# Altium schematic sheet DRV8305-Q1.SchDoc
size A4
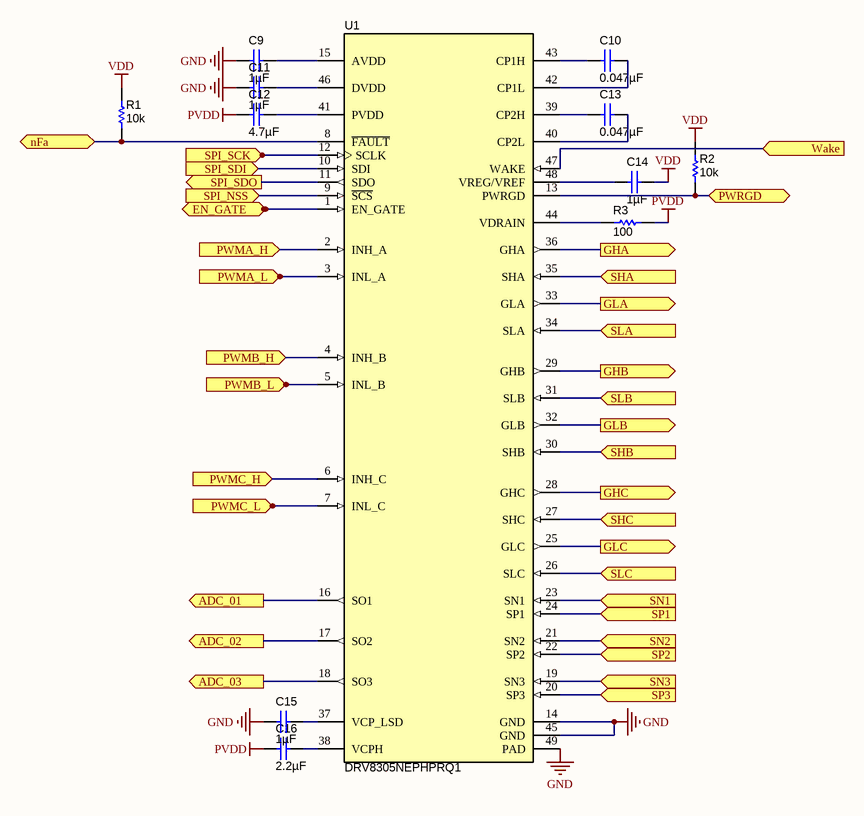
[diagram p0: DRV8305-Q1.SchDoc]

## Parts
C9  ValueDisplayed: 1µF  [0603L]  (hidden comment: C1608X7R1C105K)
C10  ValueDisplayed: 0.047µF  [0603L]  (hidden comment: C1608X7R1H473K)
C11  ValueDisplayed: 1µF  [0603L]  (hidden comment: C1608X7R1C105K)
C12  ValueDisplayed: 4.7µF  [0805L]  (hidden comment: GRM21BR71A475KA73L)
C13  ValueDisplayed: 0.047µF  [0603L]  (hidden comment: C1608X7R1H473K)
C14  ValueDisplayed: 1µF  [0603L]  (hidden comment: C1608X7R1C105K)
C15  ValueDisplayed: 1µF  [0603L]  (hidden comment: C1608X7R1C105K)
C16  ValueDisplayed: 2.2µF  [1210L]  (hidden comment: GRM32ER72A225KA35L)
R1  value 10k  [0603L]  (hidden comment: CRCW060310K0JNEA)
R2  value 10k  [0603L]  (hidden comment: CRCW060310K0JNEA)
R3  value 100  [0603L]  (hidden comment: CRCW0603100RJNEA)
U1  DRV8305NEPHPRQ1  [PHP0048G_N]

## Ports
ADC_01 (out), ADC_02 (out), ADC_03 (out), EN_GATE (in), GHA (out), GHB (out), GHC (out), GLA (out), GLB (out), GLC (out), nFa, PWMA_H (in), PWMA_L (in), PWMB_H (in), PWMB_L (in), PWMC_H (in), PWMC_L (in), PWRGD (bidir), SHA (in), SHB (in), SHC (in), SLA (in), SLB (in), SLC (in), SN1 (in), SN2 (in), SN3 (in), SP1 (in), SP2 (in), SP3 (in), SPI_NSS (in), SPI_SCK (in), SPI_SDI (in), SPI_SDO (out), Wake (in)

## Nets
GND: C9.2 C11.2 C15.2 U1.14(GND) U1.45(GND) U1.49(PAD)
PVDD: C12.2 C16.2 R3.2
VDD: C14.1 R1.2 R2.2
ADC_01: U1.16(SO1) ; port ADC_01
ADC_02: U1.17(SO2) ; port ADC_02
ADC_03: U1.18(SO3) ; port ADC_03
EN_GATE: U1.1(EN_GATE) ; port EN_GATE
GHA: U1.36(GHA) ; port GHA
GHB: U1.29(GHB) ; port GHB
GHC: U1.28(GHC) ; port GHC
GLA: U1.33(GLA) ; port GLA
GLB: U1.32(GLB) ; port GLB
GLC: U1.25(GLC) ; port GLC
nFa: R1.1 U1.8(~{FAULT}) ; port nFa
PWMA_H: U1.2(INH_A) ; port PWMA_H
PWMA_L: U1.3(INL_A) ; port PWMA_L
PWMB_H: U1.4(INH_B) ; port PWMB_H
PWMB_L: U1.5(INL_B) ; port PWMB_L
PWMC_H: U1.6(INH_C) ; port PWMC_H
PWMC_L: U1.7(INL_C) ; port PWMC_L
PWRGD: R2.1 U1.13(PWRGD) ; port PWRGD
SHA: U1.35(SHA) ; port SHA
SHB: U1.30(SHB) ; port SHB
SHC: U1.27(SHC) ; port SHC
SLA: U1.34(SLA) ; port SLA
SLB: U1.31(SLB) ; port SLB
SLC: U1.26(SLC) ; port SLC
SN1: U1.23(SN1) ; port SN1
SN2: U1.21(SN2) ; port SN2
SN3: U1.19(SN3) ; port SN3
SP1: U1.24(SP1) ; port SP1
SP2: U1.22(SP2) ; port SP2
SP3: U1.20(SP3) ; port SP3
SPI_NSS: U1.9(~{SCS}) ; port SPI_NSS
SPI_SCK: U1.12(SCLK) ; port SPI_SCK
SPI_SDI: U1.10(SDI) ; port SPI_SDI
SPI_SDO: U1.11(SDO) ; port SPI_SDO
Wake: U1.47(WAKE) ; port Wake
NetC9_1: C9.1 U1.15(AVDD)
NetC10_1: C10.1 U1.42(CP1L)
NetC10_2: C10.2 U1.43(CP1H)
NetC11_1: C11.1 U1.46(DVDD)
NetC12_1: C12.1 U1.41(PVDD)
NetC13_1: C13.1 U1.40(CP2L)
NetC13_2: C13.2 U1.39(CP2H)
NetC14_2: C14.2 U1.48(VREG/VREF)
NetC15_1: C15.1 U1.37(VCP_LSD)
NetC16_1: C16.1 U1.38(VCPH)
NetR3_1: R3.1 U1.44(VDRAIN)

## Library data of the parts
C9 C11 C14 C15 = C1608X7R1C105K: CAP, CERM, 1 µF, 16 V, +/- 10%, X7R, 0603; Manufacturer: TDK; Polarized: N; CompType: Capacitor; Value: 1uF; U/M: EA; Cap_F: 0.000001; Tolerance_%: 10; ESR_ohm: 0.0057; Value1: 0.0057 ohm; VDC_V: 16; Value2: 16V; TaMin_C: -55; TaMax_C: 125; Cap_Case: 0603; AEC Category: Q200; SymbolVersion: 2008-07-09; PartNumber: C1608X7R1C105K; PackageReference: 0603; RoHS: Y; MountType: SMT; Technology: Ceramic; TempCo: X7R; Published: 2008-06-19; Publisher: Texas Instruments; LatestRevisionDate: 2015-12-04; ComponentLink1Description: Datasheet link; ComponentLink1URL: http://www.tdk.co.jp/tefe02/e412_c.pdf; Supplier 1: Digi-Key; Supplier Part Number 1: 445-1604-1-ND; Supplier 2: Farnell; Supplier Part Number 2: 1907343; AEC Qualified: ?
C10 C13 = C1608X7R1H473K: CAP, CERM, 0.047 µF, 50 V, +/- 10%, X7R, 0603; Manufacturer: TDK; Polarized: N; CompType: Capacitor; Value: 0.047uF; U/M: EA; Cap_F: 0.000000047; Tolerance_%: 10; ESR_ohm: 0.0234; Value1: 0.0234 ohm; VDC_V: 50; Value2: 50V; TaMin_C: -55; TaMax_C: 125; Cap_Case: 0603; AEC Category: Q200; SymbolVersion: 2008-07-09; PartNumber: C1608X7R1H473K; PackageReference: 0603; RoHS: Y; MountType: SMT; Technology: Ceramic; TempCo: X7R; Published: 2008-06-19; Publisher: Texas Instruments; LatestRevisionDate: 2015-12-09; ComponentLink1Description: Datasheet link; ComponentLink1URL: http://www.tdk.co.jp/tefe02/e412_c.pdf; Supplier 1: Digi-Key; Supplier Part Number 1: 445-1313-1-ND; Supplier 2: Farnell; Supplier Part Number 2: 1907317; AEC Qualified: ?
C12 = GRM21BR71A475KA73L: CAP, CERM, 4.7 µF, 10 V, +/- 10%, X7R, 0805; Manufacturer: MuRata; Polarized: N; CompType: Capacitor; Value: 4.7uF; U/M: EA; Cap_F: 0.0000047; Tolerance_%: 10; Value1: Unknown; Value2: 10V; TaMin_C: -55; TaMax_C: 125; Cap_Case: 0805; AEC Category: Q200; SymbolVersion: 2008-07-09; PartNumber: GRM21BR71A475KA73L; PackageReference: 0805; RoHS: Y; VDC_V: 10; MountType: SMT; Technology: Ceramic; TempCo: X7R; Published: 2008-06-19; Publisher: Texas Instruments; LatestRevisionDate: 2015-12-04; ComponentLink1Description: Datasheet link; ComponentLink1URL: http://search.murata.co.jp/Ceramy/PnsearchViewAction.do?HnOFG=ON&HnNFG=ON&SEL_CNT=50&sLang=en&sKey=GRM21BR71A475KA73L&x=9&y=9&search=startwith; Supplier 1: Digi-Key; Supplier Part Number 1: GRM21BR71A475KA73L-ND; Supplier 2: Mouser; Supplier Part Number 2: 81-GRM21BR71A475KA73; Supplier 3: Farnell; Supplier Part Number 3: 1845769; AEC Qualified: ?
C16 = GRM32ER72A225KA35L: CAP, CERM, 2.2 µF, 100 V, +/- 10%, X7R, 1210; Manufacturer: MuRata; Polarized: N; CompType: Capacitor; Value: 2.2uF; U/M: EA; Cap_F: 0.0000022; Tolerance_%: 10; ESR_ohm: 0.007; Value1: 0.007 ohm; VDC_V: 100; Value2: 100V; IRMS_A: 4.4; TaMin_C: -55; TaMax_C: 125; Cap_Case: 1210; AEC Category: Q200; SymbolVersion: 2008-07-09; PartNumber: GRM32ER72A225KA35L; PackageReference: 1210; RoHS: Y; MountType: SMT; Technology: Ceramic; TempCo: X7R; Published: 2008-06-19; Publisher: Texas Instruments; LatestRevisionDate: 2015-12-04; ComponentLink1Description: Datasheet link; ComponentLink1URL: http://search.murata.co.jp/Ceramy/PnsearchViewAction.do?HnOFG=ON&HnNFG=ON&SEL_CNT=50&sLang=en&sKey=GRM32ER72A225KA35L&x=9&y=9&search=startwith; Supplier 1: Digi-Key; Supplier Part Number 1: 490-3385-1-ND; Supplier 2: Mouser; Supplier Part Number 2: 81-GRM32ER72A225KA35; Supplier 3: Farnell; Supplier Part Number 3: 1735547; AEC Qualified: ?
R1 R2 = CRCW060310K0JNEA: RES, 10 k, 5%, 0.1 W, 0603; Manufacturer: Vishay-Dale; CompType: Resistor; Res_ohm: 10000; Value_Code: 10k0; Tolerance_%: 5; Power_W: 0.1; Value2: 0.1W; VDC_V: 75; TempCo: 200 ppm/C; EIA_Code: E24; U/M: EA; AEC Category: Q200; SymbolVersion: 2009-05-29; PartNumber: CRCW060310K0JNEA; PackageReference: 0603; RoHS: Y; Value1: 5%; MountType: SMT; Technology: Thick Film; Published: 2008-06-26; Publisher: Texas Instruments; LatestRevisionDate: 2015-11-22; ComponentLink1Description: Datasheet link; ComponentLink1URL: http://www.vishay.com/docs/20035/dcrcwe3.pdf; Supplier 1: Digi-Key; Supplier Part Number 1: 541-10KGCT-ND; Supplier 2: Mouser; Supplier Part Number 2: 71-CRCW0603J-10K-E3; Supplier 3: Farnell; Supplier Part Number 3: 1469749; ValueDisplayed: 10k; AEC Qualified: ?
R3 = CRCW0603100RJNEA: RES, 100, 5%, 0.1 W, 0603; Manufacturer: Vishay-Dale; CompType: Resistor; Value_Code: 100R; Tolerance_%: 5; Power_W: 0.1; Value2: 0.1W; VDC_V: 75; TempCo: 200 ppm/C; EIA_Code: E24; U/M: EA; AEC Category: Q200; SymbolVersion: 2009-05-29; PartNumber: CRCW0603100RJNEA; PackageReference: 0603; RoHS: Y; Res_ohm: 100; Value1: 5%; MountType: SMT; Technology: Thick Film; Published: 2008-06-26; Publisher: Texas Instruments; LatestRevisionDate: 2015-11-22; ComponentLink1Description: Datasheet link; ComponentLink1URL: http://www.vishay.com/docs/20035/dcrcwe3.pdf; Supplier 1: Digi-Key; Supplier Part Number 1: 541-100GCT-ND; Supplier 2: Mouser; Supplier Part Number 2: 71-CRCW0603J-100-E3; Supplier 3: Farnell; Supplier Part Number 3: 1514715; ValueDisplayed: 100; AEC Qualified: ?
U1 = DRV83053EPHPRQ1: Three Phase Automotive Gate Driver with Three Integrated Current Shunt Amplifiers and Voltage Regulator, PHP0048G; Alternate PartNumber: DRV8305NEPHPQ1; Manufacturer: Texas Instruments; SymbolCreator: Altium; CompType: IC; U/M: EA; SymbolVersion: 2015-02-03; PartNumber: DRV8305NEPHPRQ1; PackageReference: PHP0048G; MountType: SMT; ComponentLink1Description: Datasheet Link; ComponentLink1URL: https://sps06.itg.ti.com/sites/KMS/crossdivteams/altium/docs/ComponentDatasheets/TI_Q100_3PhPredriver_DRV8305_v9.pdf; Publisher: Texas Instruments; LatestRevisionDate: 2015-12-21; Alternate Manufacturer: Texas Instruments